# Altium schematic sheet cell_fuses.SchDoc
size 392 x 280 mm
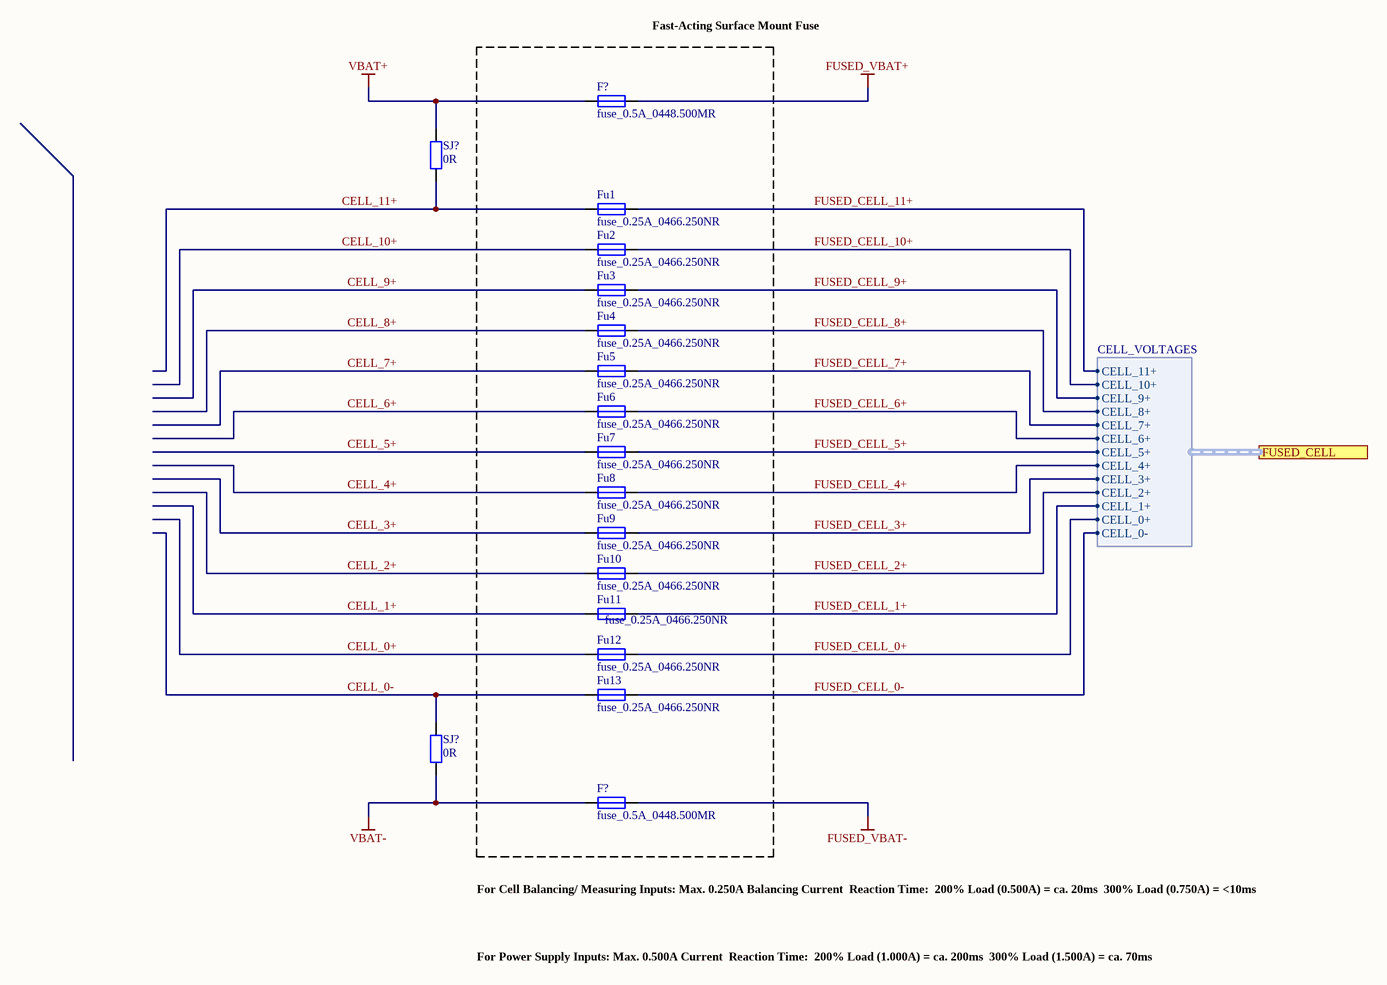
[diagram p0: cell_fuses.SchDoc]

## Parts
(Parts that share a designator on the sheet are numbered #1, #2 ... from top to bottom, then left to right.)
F?#1  fuse_0.5A_0448.500MR  [LITTLEFUSE_448]
F?#2  fuse_0.5A_0448.500MR  [LITTLEFUSE_448]
Fu1  fuse_0.25A_0466.250NR  [LITTLEFUSE_466]
Fu2  fuse_0.25A_0466.250NR  [LITTLEFUSE_466]
Fu3  fuse_0.25A_0466.250NR  [LITTLEFUSE_466]
Fu4  fuse_0.25A_0466.250NR  [LITTLEFUSE_466]
Fu5  fuse_0.25A_0466.250NR  [LITTLEFUSE_466]
Fu6  fuse_0.25A_0466.250NR  [LITTLEFUSE_466]
Fu7  fuse_0.25A_0466.250NR  [LITTLEFUSE_466]
Fu8  fuse_0.25A_0466.250NR  [LITTLEFUSE_466]
Fu9  fuse_0.25A_0466.250NR  [LITTLEFUSE_466]
Fu10  fuse_0.25A_0466.250NR  [LITTLEFUSE_466]
Fu11  fuse_0.25A_0466.250NR  [LITTLEFUSE_466]
Fu12  fuse_0.25A_0466.250NR  [LITTLEFUSE_466]
Fu13  fuse_0.25A_0466.250NR  [LITTLEFUSE_466]
SJ?#1  0R  [RESC1608X05N]
SJ?#2  0R  [RESC1608X05N]

## Blocks framed on the sheet
Fast-Acting Surface Mount Fuse: F?#1 F?#2 Fu1-Fu13

## Ports
FUSED_CELL (harness CELL_VOLTAGES)

## Harnesses
CELL_VOLTAGES: CELL_0-, CELL_0+, CELL_1+, CELL_10+, CELL_11+, CELL_2+, CELL_3+, CELL_4+, CELL_5+, CELL_6+, CELL_7+, CELL_8+, CELL_9+

## Nets
FUSED_VBAT+: F?#1.2
FUSED_VBAT-: F?#2.2
VBAT+: F?#1.1 SJ?#1.1
VBAT-: F?#2.1 SJ?#2.2
CELL_0+: Fu12.1
CELL_0-: Fu13.1 SJ?#2.1
CELL_1+: Fu11.1
CELL_2+: Fu10.1
CELL_3+: Fu9.1
CELL_4+: Fu8.1
CELL_5+: Fu7.1
CELL_6+: Fu6.1
CELL_7+: Fu5.1
CELL_8+: Fu4.1
CELL_9+: Fu3.1
CELL_10+: Fu2.1
CELL_11+: Fu1.1 SJ?#1.2
FUSED_CELL_0+: Fu12.2 ; port FUSED_CELL.CELL_0+
FUSED_CELL_0-: Fu13.2 ; port FUSED_CELL.CELL_0-
FUSED_CELL_1+: Fu11.2 ; port FUSED_CELL.CELL_1+
FUSED_CELL_2+: Fu10.2 ; port FUSED_CELL.CELL_2+
FUSED_CELL_3+: Fu9.2 ; port FUSED_CELL.CELL_3+
FUSED_CELL_4+: Fu8.2 ; port FUSED_CELL.CELL_4+
FUSED_CELL_5+: Fu7.2 ; port FUSED_CELL.CELL_5+
FUSED_CELL_6+: Fu6.2 ; port FUSED_CELL.CELL_6+
FUSED_CELL_7+: Fu5.2 ; port FUSED_CELL.CELL_7+
FUSED_CELL_8+: Fu4.2 ; port FUSED_CELL.CELL_8+
FUSED_CELL_9+: Fu3.2 ; port FUSED_CELL.CELL_9+
FUSED_CELL_10+: Fu2.2 ; port FUSED_CELL.CELL_10+
FUSED_CELL_11+: Fu1.2 ; port FUSED_CELL.CELL_11+

## Notes on the sheet
- For Cell Balancing/ Measuring Inputs: Max. 0.250A Balancing Current
  Reaction Time:
  200% Load (0.500A) = ca. 20ms
  300% Load (0.750A) = <10ms
- For Power Supply Inputs: Max. 0.500A Current
  Reaction Time:
  200% Load (1.000A) = ca. 200ms
  300% Load (1.500A) = ca. 70ms

## Library data of the parts
F?#1 F?#2 = fuse_0.5A_0448.500MR: Fuse, Surface Mount, NANO2 Series, 500 mA, 125 VAC, 32 VDC, Very Fast Acting, SMD; Manufacturer: Littlefuse; Automotive Qualified: False; Part Number: fuse_0.5A_0448.500MR; Operating Temperature: -55°C - +125°C; ComponentLink1Description: Datasheet; ComponentLink1URL: http://www.farnell.com/datasheets/1792947.pdf; Supplier 1: Farnell; Supplier Part Number 1: 1596919
Fu1-Fu13 = fuse_0.25A_0466.250NR: Fuse, Surface Mount, 466 Series, 250 mA, 125 VAC, 125 VDC, Very Fast Acting, 1206; Manufacturer: Littlefuse; Automotive Qualified: False; Part Number: fuse_0.25A_0466.250NR; Operating Temperature: -55°C - +90°C; ComponentLink1Description: Datasheet; ComponentLink1URL: http://www.farnell.com/datasheets/1796765.pdf; Supplier 1: Farnell; Supplier Part Number 1: 9921826
SJ?#1 SJ?#2 = gen_R_0R_0603: SMD Resistor 0R 0603; Power: 0.1W; Case EIA: 0603; Case Metric: 1608; Maximum Working Voltage: 75V; PnP Package: R_0603; Automotive Qualified: False; Part Number: gen_R_0R_0603; Operating Temperature: -55°C - +155°C; Resistance: 0R; Series: Jumper; PnP Value: 0R; Supplier 1: Farnell; Supplier Part Number 1: 2073345